# Altium project PCB_Project1.PrjPCB
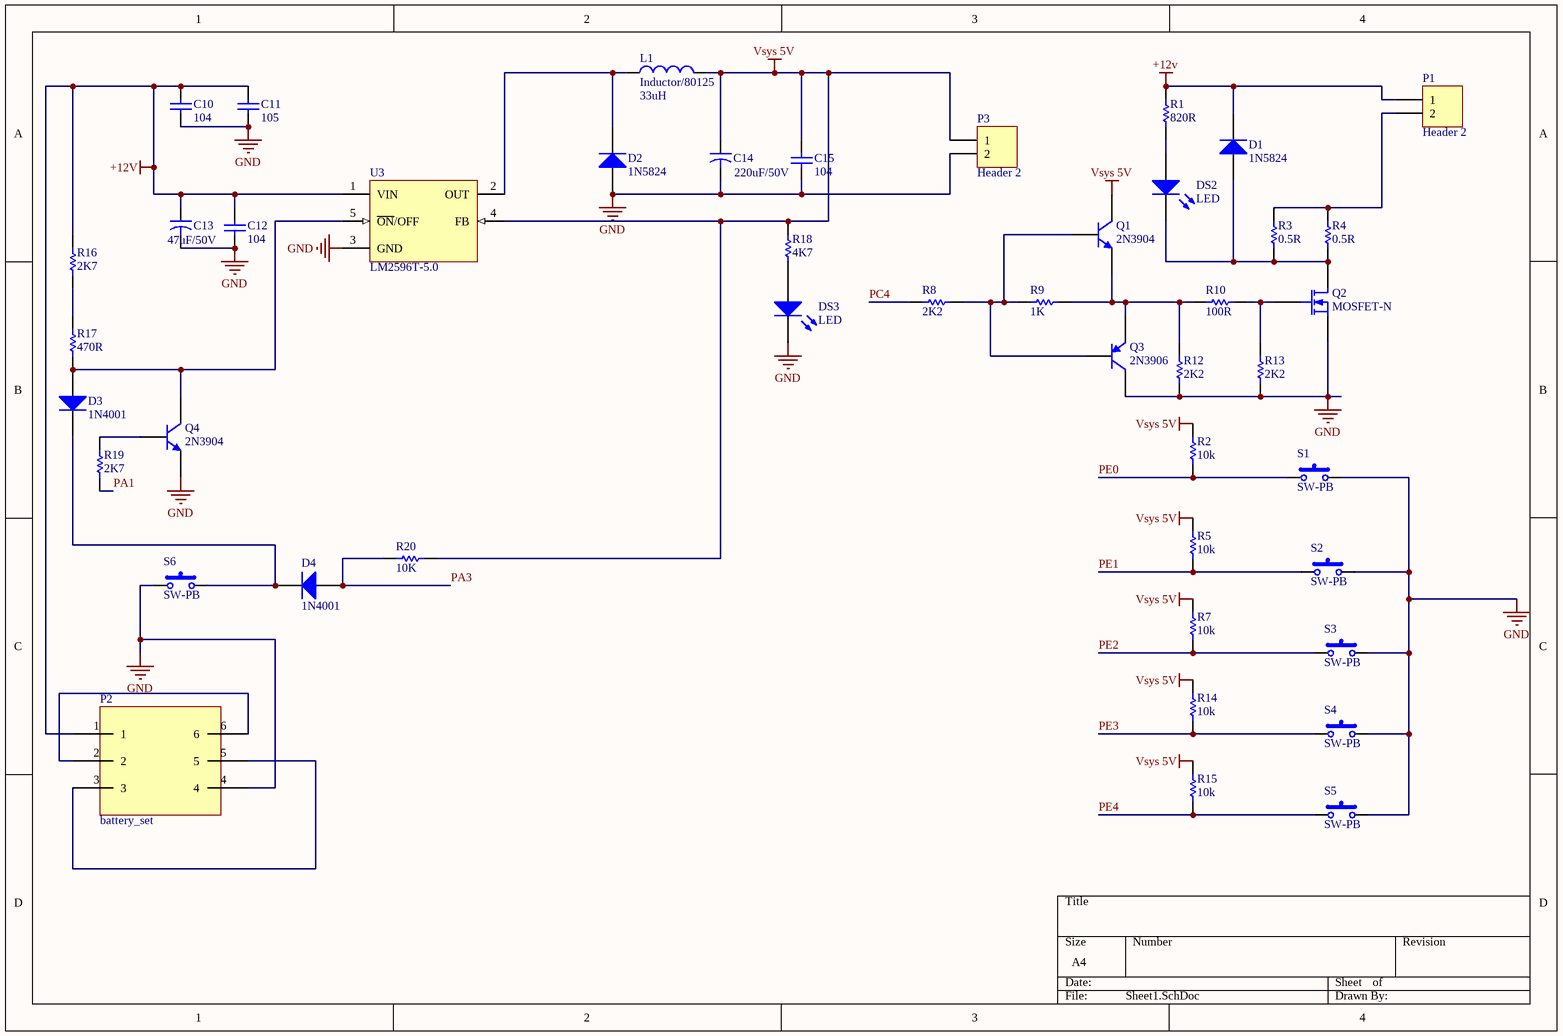
[diagram p0: Sheet1.SchDoc]
2 sheets, 61 parts. Net scope: global (net labels, ports and power ports of the same name join across sheets).
Board file: PCB1.PcbDoc
Sheets:
  Sheet1.SchDoc
  Sheet2.SchDoc

## Sheet Sheet1.SchDoc
size A4

### Parts
C10  104  [C200]
C11  105  [C200]
C12  104  [C200]
C13  value 47uF/50V  [CAPR5-4X5]  (hidden comment: Cap2)
C14  value 220uF/50V  [CAPR5-4X5]  (hidden comment: Cap2)
C15  104  [C200]
D1  1N5824  [DO-201AD]
D2  1N5824  [DO-201AD]
D3  1N4001  [DO-41]
D4  1N4001  [DO-41]
DS2  LED  [LED-0]
DS3  LED  [LED-0]
L1  Inductor/80125  value 33uH  [T080125]
P1  Header 2  [HDR1X2]
P2  battery_set  [BATTERY_SET]
P3  Header 2  [HDR1X2]
Q1  2N3904  [TO-92A]
Q2  MOSFET-N  [E3]
Q3  2N3906  [TO-92A]
Q4  2N3904  [TO-92A]
R1  820R  [AXIAL-0.3]
R2  10k  [AXIAL-0.3]
R3  0.5R  [AXIAL-0.3]
R4  0.5R  [AXIAL-0.3]
R5  10k  [AXIAL-0.3]
R7  10k  [AXIAL-0.3]
R8  2K2  [AXIAL-0.3]
R9  1K  [AXIAL-0.3]
R10  100R  [AXIAL-0.3]
R12  2K2  [AXIAL-0.3]
R13  2K2  [AXIAL-0.3]
R14  10k  [AXIAL-0.3]
R15  10k  [AXIAL-0.3]
R16  2K7  [AXIAL-0.3]
R17  470R  [AXIAL-0.3]
R18  4K7  [AXIAL-0.3]
R19  2K7  [AXIAL-0.3]
R20  10K  [AXIAL-0.3]
S1  SW-PB  [TACK6]
S2  SW-PB  [TACK6]
S3  SW-PB  [TACK6]
S4  SW-PB  [TACK6]
S5  SW-PB  [TACK6]
S6  SW-PB  [TACK6]
U3  LM2596T-5.0  [T05D]

### Nets
+12v: C10.2 C11.2 C12.2 C13.1 D1.2(K) P1.1 P2.1 R1.2 R16.2 U3.1(VIN)
GND: C10.1 C11.1 C12.1 C13.2 C14.2 C15.1 D2.1(A) DS3.2(K) P2.4 P3.2 Q2.3(S) Q3.3(C) Q4.1(E) R12.2 R13.2 S1.2 S2.2 S3.2 S4.2 S5.2 S6.1 U3.3(GND)
Vsys 5V: C14.1 C15.2 L1.2 P3.1 Q1.3(C) R2.2 R5.1 R7.1 R14.1 R15.1 R18.2 R20.1 U3.4(FB)
PA1: R19.1
PA3: D4.1(A) R20.2
PC4: R8.2
PE0: R2.1 S1.1
PE1: R5.2 S2.1
PE2: R7.2 S3.1
PE3: R14.2 S4.1
PE4: R15.2 S5.1
NetD1_1: D1.1(A) DS2.2(K) Q2.1(D) R3.1 R4.1
NetD2_2: D2.2(K) L1.1 U3.2(OUT)
NetD3_1: D3.1(A) Q4.3(C) R17.1 U3.5(~{ON}/OFF)
NetD3_2: D3.2(K) D4.2(K) S6.2
NetDS2_1: DS2.1(A) R1.1
NetDS3_1: DS3.1(A) R18.1
NetP1_2: P1.2 R3.2 R4.2
NetP2_2: P2.2 P2.6
NetP2_3: P2.3 P2.5
NetQ1_1: Q1.1(E) Q3.1(E) R9.1 R10.2 R12.1
NetQ1_2: Q1.2(B) Q3.2(B) R8.1 R9.2
NetQ2_2: Q2.2(G) R10.1 R13.1
NetQ4_2: Q4.2(B) R19.2
NetR16_1: R16.1 R17.2

### Library data of the parts
C10-C12 C15 = Cap: Capacitor; Published: 8-Jun-2000; LatestRevisionDate: 17-Jul-2002; LatestRevisionNote: Re-released for DXP Platform.; PackageReference: RAD-0.3; Publisher: Altium Limited
C13 C14 = Cap2: Capacitor; Published: 23-Sep-2002; PackageReference: CAPR5-4X5; Publisher: Altium Limited; PackageDescription: Capacitor; 2 Leads
D1 D2 = Diode 1N5408: 3 Amp Medium Power Silicon Rectifier Diode; Published: 8-Jun-2000; LatestRevisionDate: 17-Jul-2002; LatestRevisionNote: Re-released for DXP Platform.; DatasheetVersion: Aug-1984; PackageReference: DO-201AD; Publisher: Altium Limited; PackageDescription: Diode, Axial; Body 9.5 x 5.3 mm (LxDia. max), Lead Dia. 1.32 mm (max); ComponentLink1Description: Manufacturer Link; ComponentLink1URL: http://www.irf.com/
D3 D4 = Diode 1N4001: 1 Amp General Purpose Rectifier; Published: 8-Jun-2000; LatestRevisionDate: 17-Jul-2002; LatestRevisionNote: Re-released for DXP Platform.; DatasheetVersion: 1998; PackageVersion: Aug-1999; PackageReference: DO-41; Publisher: Altium Limited; PackageDescription: Diode, Axial; Body 5.2 x 2.7 mm (LxDia. max), Lead Dia. 0.86 mm (max); Code_JEDEC: DO-204-AL; ComponentLink1Description: Manufacturer Link; ComponentLink1URL: http://www.fairchildsemi.com/; ComponentLink2Description: Datasheet; ComponentLink2URL: http://www.fairchildsemi.com/ds/1N%2F1N4001.pdf
DS2 DS3 = LED0: Typical INFRARED GaAs LED; Published: 8-Jun-2000; LatestRevisionDate: 08-Jul-2005; LatestRevisionNote: Mech Layer 1 removed.; PackageReference: LED-0; Publisher: Altium Limited; PackageDescription: LED; 2 Leads
L1 = Inductor: Code_IEC: 1005; Published: 8-Jun-2000; LatestRevisionDate: 29-May-2009; LatestRevisionNote: IPC-7351 Footprint Added.; PackageReference: 0402-A; Publisher: Altium Limited; PackageDescription: Chip Inductor; Code_JEITA: 0402
P1 P3 = Header 2: Header, 2-Pin; LatestRevisionDate: 17-Jul-2002; LatestRevisionNote: Re-released for DXP Platform.; Publisher: Altium Limited
Q1 Q4 = 2N3904: NPN General Purpose Amplifier; Published: 8-Jun-2000; LatestRevisionDate: 15-Jan-2003; LatestRevisionNote: PCB Footprint 'BCY-W3/D4.7' replaced; DatasheetVersion: 1997; PackageVersion: Sep-1998; PackageReference: TO-92A; Publisher: Altium Limited; PackageDescription: TO, Flat Index; 3 In-Line, Axial Leads; Body Dia. 4.5mm; Leads 0.51 x 0.48 mm (max); ComponentLink1Description: Manufacturer Link; ComponentLink1URL: http://www.fairchildsemi.com/; ComponentLink2Description: Datasheet; ComponentLink2URL: http://www.fairchildsemi.com/ds/2N%2F2N3904.pdf
Q2 = MOSFET-N: N-Channel MOSFET; Published: 8-Jun-2000; LatestRevisionDate: 17-Jul-2002; LatestRevisionNote: Re-released for DXP Platform.; PackageVersion: 1995/1996; PackageReference: E3; Publisher: Altium Limited; PackageDescription: TO, Flat Index; 3 In-Line, Axial Leads; Body Dia. 4.6mm; Lead Dia. 0.5 mm (max)
Q3 = 2N3906: PNP General Purpose Amplifier; Published: 8-Jun-2000; LatestRevisionDate: 15-Jan-2003; LatestRevisionNote: PCB Footprint 'BCY-W3/D4.7' replaced; DatasheetVersion: 1997; PackageVersion: Sep-1998; PackageReference: TO-92A; Publisher: Altium Limited; PackageDescription: TO, Flat Index; 3 In-Line, Axial Leads; Body Dia. 4.5mm; Leads 0.51 x 0.48 mm (max); ComponentLink1Description: Manufacturer Link; ComponentLink1URL: http://www.fairchildsemi.com/; ComponentLink2Description: Datasheet; ComponentLink2URL: http://www.fairchildsemi.com/ds/2N%2F2N3906.pdf
R1-R5 R7-R10 R12-R20 = Res: Resistor; Published: 8-Jun-2000; LatestRevisionDate: 17-Jul-2002; LatestRevisionNote: Re-released for DXP Platform.; PackageReference: AXIAL-0.3; Publisher: Altium Limited
S1-S6 = SW-PB: Switch; Published: 24-Mar-1999; LatestRevisionDate: 17-Jul-2002; LatestRevisionNote: Re-released for DXP Platform.; PackageReference: SPST-2; Publisher: Altium Limited
U3 = LM2596T-5.0: SIMPLE SWITCHER?Power Converter 150 KHz 3A Step-Down Voltage Regulator, 5-pin TO-220; Manufacturer: National Semiconductor; PackageTopMarking: NSUZXYTTE#*LM2596T*-5.0 P+; PowerWise: N; Published: 4-Dec-2008; DatasheetVersion: May-2002; PackageVersion: revA, Oct-1989; PackageReference: T05D; Publisher: Altium Limited; PackageDescription: TO-220, Molded, Stagger Bend, 5 Lead; Supplier 1: Farnell; Supplier Part Number 1: 1206529; PartNumber: LM2596T-5.0; RoHS: N; PinCount: 5; CompType: Switcher; ComponentLink1Description: LM2596 Datasheet; ComponentLink1URL: http://www.national.com/ds/LM/LM2596.pdf; ComponentLink2Description: LM2596 Web Page; ComponentLink2URL: http://www.national.com/pf/LM/LM2596.html; ComponentLink3Description: T05D Package Page; ComponentLink3URL: http://www.national.com/packaging/folders/t05d.html

## Sheet Sheet2.SchDoc
size A4
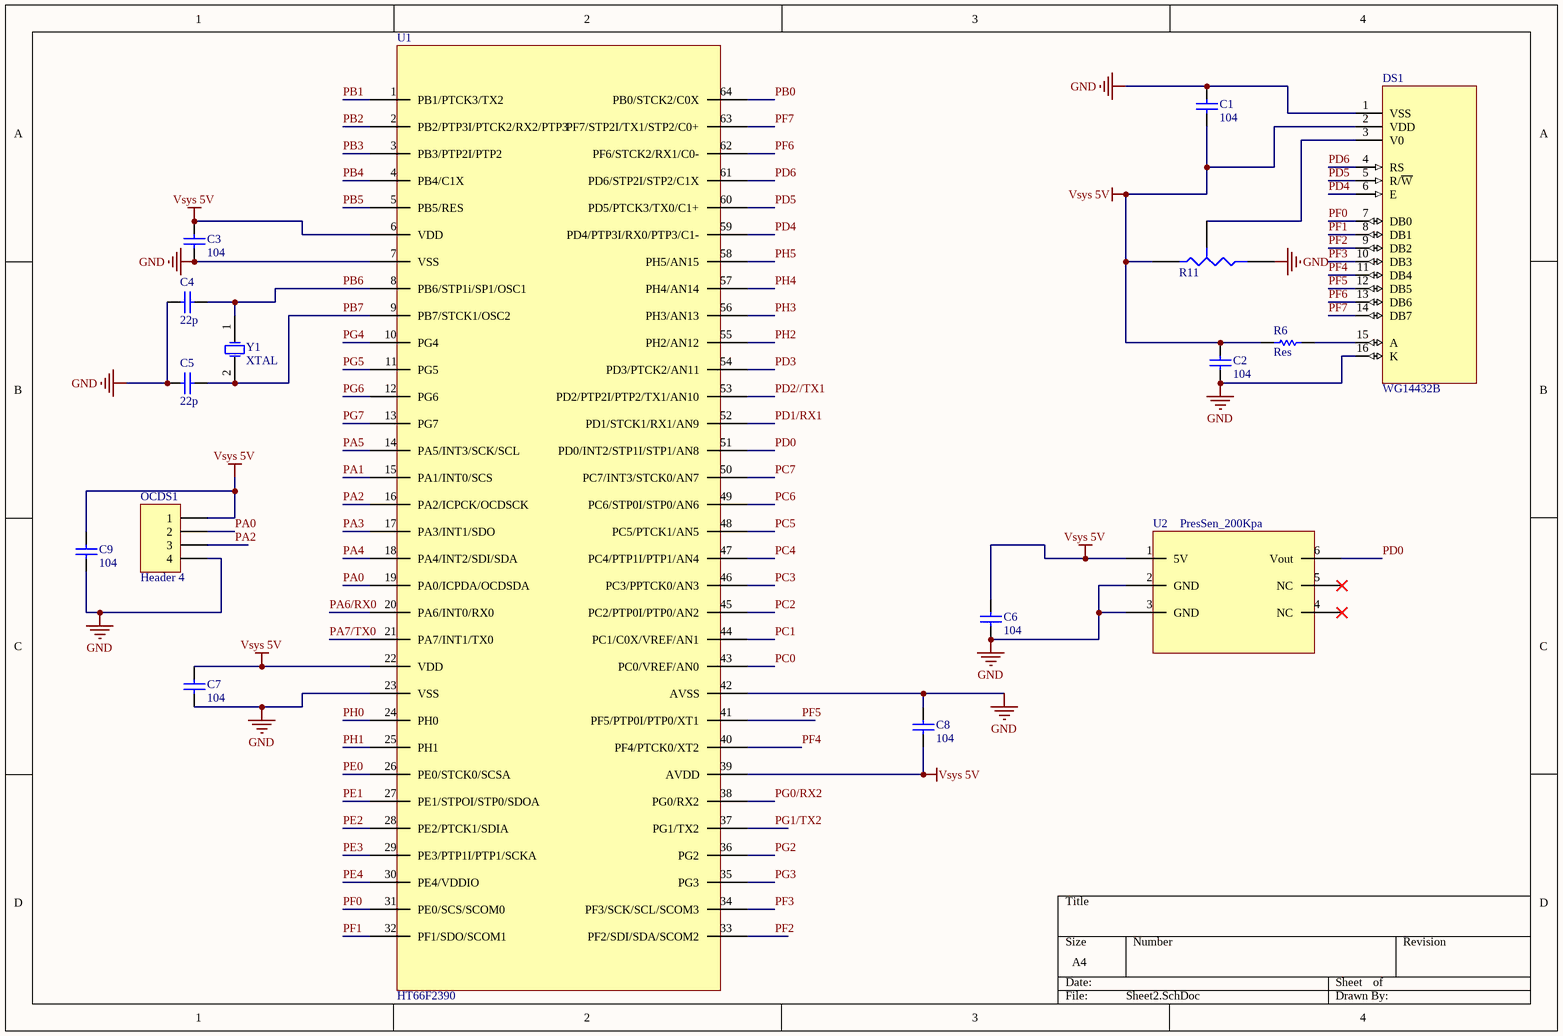
[diagram p1: Sheet2.SchDoc]

### Parts
C1  104  [C200]
C2  104  [C200]
C3  104  [C200]
C4  22p  [C200]
C5  22p  [C200]
C6  104  [C200]
C7  104  [C200]
C8  104  [C200]
C9  104  [C200]
DS1  WG14432B  [LCM_16]
OCDS1  Header 4  [HDR1X4]
R6  Res  [AXIAL-0.3]
R11  Res Tap  [VR3]  (value not drawn)
U1  HT66F2390  [LFPQ-64]
U2  PresSen_200Kpa  [RSCM17100Kxxxx]
Y1  XTAL  [XTAL4-8]

### Nets
GND: C1.2 C2.1 C3.1 C4.1 C5.1 C6.1 C7.1 C8.2 C9.1 DS1.1(VSS) DS1.16(K) OCDS1.4 R11.2(B) U1.7(VSS) U1.23(VSS) U1.42(AVSS) U2.2(GND) U2.3(GND)
Vsys 5V: C1.1 C2.2 C3.2 C6.2 C7.2 C8.1 C9.2 DS1.2(VDD) OCDS1.1 R6.1 R11.1(A) U1.6(VDD) U1.22(VDD) U1.39(AVDD) U2.1(5V)
PA0: OCDS1.2 U1.19(PA0/ICPDA/OCDSDA)
PA1: U1.15(PA1/INT0/SCS)
PA2: OCDS1.3 U1.16(PA2/ICPCK/OCDSCK)
PA3: U1.17(PA3/INT1/SDO)
PA4: U1.18(PA4/INT2/SDI/SDA)
PA5: U1.14(PA5/INT3/SCK/SCL)
PA6/RX0: U1.20(PA6/INT0/RX0)
PA7/TX0: U1.21(PA7/INT1/TX0)
PB0: U1.64(PB0/STCK2/C0X)
PB1: U1.1(PB1/PTCK3/TX2)
PB2: U1.2(PB2/PTP3I/PTCK2/RX2/PTP3)
PB3: U1.3(PB3/PTP2I/PTP2)
PB4: U1.4(PB4/C1X)
PB5: U1.5(PB5/RES)
PB6: C4.2 U1.8(PB6/STP1i/SP1/OSC1) Y1.1(OSC1)
PB7: C5.2 U1.9(PB7/STCK1/OSC2) Y1.2(OSC2)
PC0: U1.43(PC0/VREF/AN0)
PC1: U1.44(PC1/C0X/VREF/AN1)
PC2: U1.45(PC2/PTP0I/PTP0/AN2)
PC3: U1.46(PC3/PPTCK0/AN3)
PC4: U1.47(PC4/PTP1I/PTP1/AN4)
PC5: U1.48(PC5/PTCK1/AN5)
PC6: U1.49(PC6/STP0I/STP0/AN6)
PC7: U1.50(PC7/INT3/STCK0/AN7)
PD0: U1.51(PD0/INT2/STP1I/STP1/AN8) U2.6(Vout)
PD1/RX1: U1.52(PD1/STCK1/RX1/AN9)
PD2//TX1: U1.53(PD2/PTP2I/PTP2/TX1/AN10)
PD3: U1.54(PD3/PTCK2/AN11)
PD4: DS1.6(E) U1.59(PD4/PTP3I/RX0/PTP3/C1-)
PD5: DS1.5(R/~{W}) U1.60(PD5/PTCK3/TX0/C1+)
PD6: DS1.4(RS) U1.61(PD6/STP2I/STP2/C1X)
PE0: U1.26(PE0/STCK0/SCSA)
PE1: U1.27(PE1/STPOI/STP0/SDOA)
PE2: U1.28(PE2/PTCK1/SDIA)
PE3: U1.29(PE3/PTP1I/PTP1/SCKA)
PE4: U1.30(PE4/VDDIO)
PF0: DS1.7(DB0) U1.31(PE0/SCS/SCOM0)
PF1: DS1.8(DB1) U1.32(PF1/SDO/SCOM1)
PF2: DS1.9(DB2) U1.33(PF2/SDI/SDA/SCOM2)
PF3: DS1.10(DB3) U1.34(PF3/SCK/SCL/SCOM3)
PF4: DS1.11(DB4) U1.40(PF4/PTCK0/XT2)
PF5: DS1.12(DB5) U1.41(PF5/PTP0I/PTP0/XT1)
PF6: DS1.13(DB6) U1.62(PF6/STCK2/RX1/C0-)
PF7: DS1.14(DB7) U1.63(PF7/STP2I/TX1/STP2/C0+)
PG0/RX2: U1.38(PG0/RX2)
PG1/TX2: U1.37(PG1/TX2)
PG2: U1.36(PG2)
PG3: U1.35(PG3)
PG4: U1.10(PG4)
PG5: U1.11(PG5)
PG6: U1.12(PG6)
PG7: U1.13(PG7)
PH0: U1.24(PH0)
PH1: U1.25(PH1)
PH2: U1.55(PH2/AN12)
PH3: U1.56(PH3/AN13)
PH4: U1.57(PH4/AN14)
PH5: U1.58(PH5/AN15)
NetDS1_3: DS1.3(V0) R11.3(TAP)
NetDS1_15: DS1.15(A) R6.2

Not connected (* = marked no-connect by the designer): U2 4(NC)* 5(NC)*

### Library data of the parts
C1-C9 = Cap: Capacitor; Published: 8-Jun-2000; LatestRevisionDate: 17-Jul-2002; LatestRevisionNote: Re-released for DXP Platform.; PackageReference: RAD-0.3; Publisher: Altium Limited
DS1 = WG14432B: LCD Module
OCDS1 = Header 4: Header, 4-Pin; LatestRevisionDate: 17-Jul-2002; LatestRevisionNote: Re-released for DXP Platform.; Publisher: Altium Limited
R6 = Res: Resistor; Published: 8-Jun-2000; LatestRevisionDate: 17-Jul-2002; LatestRevisionNote: Re-released for DXP Platform.; PackageReference: AXIAL-0.3; Publisher: Altium Limited
R11 = Res Tap: Tapped Resistor; Sim Note: Enter the Resistance value and the set point into parameter fields.; Set Position: 0.5; Value: 1K; Published: 24-Mar-1999; LatestRevisionDate: 17-Jul-2002; LatestRevisionNote: Re-released for DXP Platform.; PackageReference: VR3; Publisher: Altium Limited; PackageDescription: Variable Resistor, Thru-Hole; 3 Leads
Y1 = XTAL: Crystal Oscillator; Published: 8-Jun-2000; LatestRevisionDate: 17-Jul-2002; LatestRevisionNote: Re-released for DXP Platform.; PackageReference: R38; Publisher: Altium Limited

## Nets that join several sheets
GND: Sheet1 (22 pins), Sheet2 (18 pins)
Vsys 5V: Sheet1 (13 pins), Sheet2 (15 pins)
PA1: Sheet1 (R19.1), Sheet2 (U1.15)
PA3: Sheet1 (D4.1 R20.2), Sheet2 (U1.17)
PC4: Sheet1 (R8.2), Sheet2 (U1.47)
PE0: Sheet1 (R2.1 S1.1), Sheet2 (U1.26)
PE1: Sheet1 (R5.2 S2.1), Sheet2 (U1.27)
PE2: Sheet1 (R7.2 S3.1), Sheet2 (U1.28)
PE3: Sheet1 (R14.2 S4.1), Sheet2 (U1.29)
PE4: Sheet1 (R15.2 S5.1), Sheet2 (U1.30)